# EasyEDA schematic Pendu_LED_10mm.json
TITLE: Sheet_1; REV: 1.0; Date: 2024-11-20; Sheet: 1/1; Drawn By: AmirB; Company: Your Company
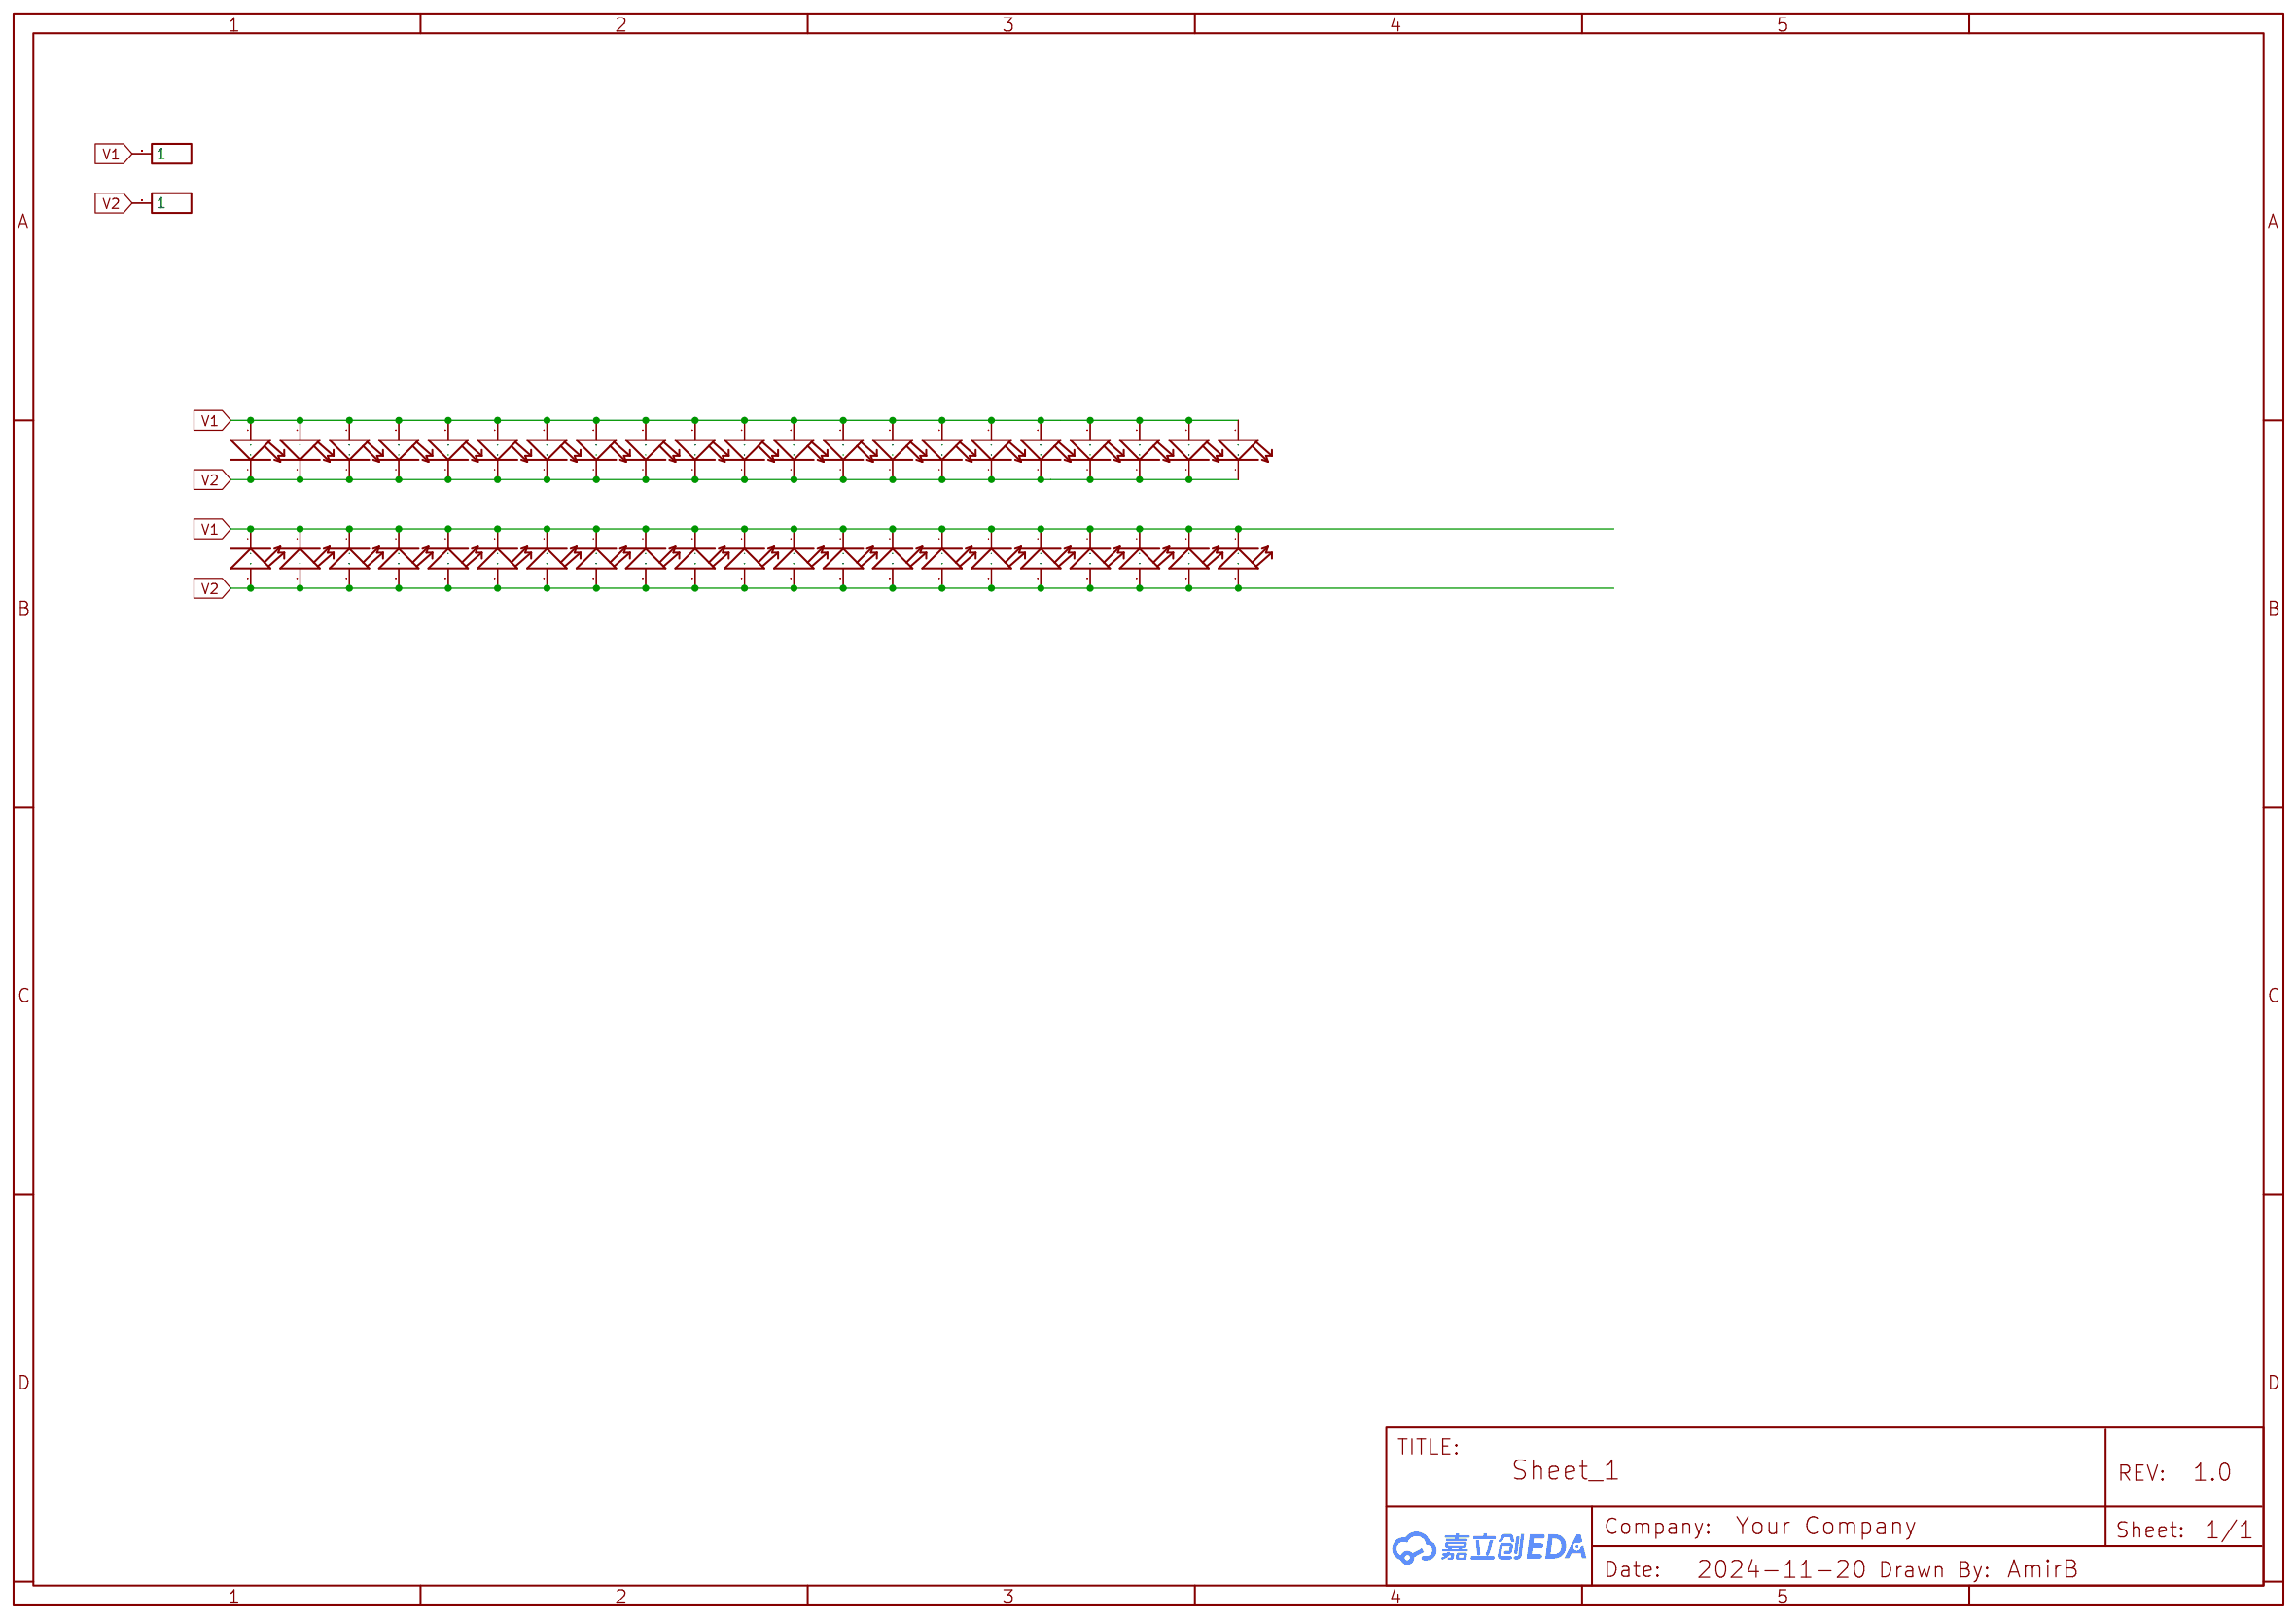
[diagram p0: schematic sheet]

## Parts
J1  HDR-M-2.54_1x1  [HDR-M-2.54_1X1]
J2  HDR-M-2.54_1x1  [HDR-M-2.54_1X1]
LD1  1004OUW  [LED2-2.54-D10MM]
LD2  1004OUW  [LED2-2.54-D10MM]
LD3  1004OUW  [LED2-2.54-D10MM]
LD4  1004OUW  [LED2-2.54-D10MM]
LD5  1004OUW  [LED2-2.54-D10MM]
LD6  1004OUW  [LED2-2.54-D10MM]
LD7  1004OUW  [LED2-2.54-D10MM]
LD8  1004OUW  [LED2-2.54-D10MM]
LD9  1004OUW  [LED2-2.54-D10MM]
LD10  1004OUW  [LED2-2.54-D10MM]
LD11  1004OUW  [LED2-2.54-D10MM]
LD12  1004OUW  [LED2-2.54-D10MM]
LD13  1004OUW  [LED2-2.54-D10MM]
LD14  1004OUW  [LED2-2.54-D10MM]
LD15  1004OUW  [LED2-2.54-D10MM]
LD16  1004OUW  [LED2-2.54-D10MM]
LD17  1004OUW  [LED2-2.54-D10MM]
LD18  1004OUW  [LED2-2.54-D10MM]
LD19  1004OUW  [LED2-2.54-D10MM]
LD20  1004OUW  [LED2-2.54-D10MM]
LD21  1004OUW  [LED2-2.54-D10MM]
LU1  1004OUW  [LED2-2.54-D10MM]
LU2  1004OUW  [LED2-2.54-D10MM]
LU3  1004OUW  [LED2-2.54-D10MM]
LU4  1004OUW  [LED2-2.54-D10MM]
LU5  1004OUW  [LED2-2.54-D10MM]
LU6  1004OUW  [LED2-2.54-D10MM]
LU7  1004OUW  [LED2-2.54-D10MM]
LU8  1004OUW  [LED2-2.54-D10MM]
LU9  1004OUW  [LED2-2.54-D10MM]
LU10  1004OUW  [LED2-2.54-D10MM]
LU11  1004OUW  [LED2-2.54-D10MM]
LU12  1004OUW  [LED2-2.54-D10MM]
LU13  1004OUW  [LED2-2.54-D10MM]
LU14  1004OUW  [LED2-2.54-D10MM]
LU15  1004OUW  [LED2-2.54-D10MM]
LU16  1004OUW  [LED2-2.54-D10MM]
LU17  1004OUW  [LED2-2.54-D10MM]
LU18  1004OUW  [LED2-2.54-D10MM]
LU19  1004OUW  [LED2-2.54-D10MM]
LU20  1004OUW  [LED2-2.54-D10MM]
LU21  1004OUW  [LED2-2.54-D10MM]

## Library data of the parts
J1 J2 = HDR-M-2.54_1x1: Supplier Part: C81276; Supplier: LCSC; Contributor: LCEDA_Lib; Package Display: No
LD1-LD21 LU1-LU21 = 1004OUW: DIP LED white transparent-Orange-10mm;; catid: 20; Contributor: gh2000; Package Display: No

## Nets
V1: J1.1 LD1.- LD2.- LD3.- LD4.- LD5.- LD6.- LD7.- LD8.- LD9.- LD10.- LD11.- LD12.- LD13.- LD14.- LD15.- LD16.- LD17.- LD18.- LD19.- LD20.- LD21.- LU1.+ LU2.+ LU3.+ LU4.+ LU5.+ LU6.+ LU7.+ LU8.+ LU9.+ LU10.+ LU11.+ LU12.+ LU13.+ LU14.+ LU15.+ LU16.+ LU17.+ LU18.+ LU19.+ LU20.+ LU21.+
V2: J2.1 LD1.+ LD2.+ LD3.+ LD4.+ LD5.+ LD6.+ LD7.+ LD8.+ LD9.+ LD10.+ LD11.+ LD12.+ LD13.+ LD14.+ LD15.+ LD16.+ LD17.+ LD18.+ LD19.+ LD20.+ LD21.+ LU1.- LU2.- LU3.- LU4.- LU5.- LU6.- LU7.- LU8.- LU9.- LU10.- LU11.- LU12.- LU13.- LU14.- LU15.- LU16.- LU17.- LU18.- LU19.- LU20.- LU21.-
